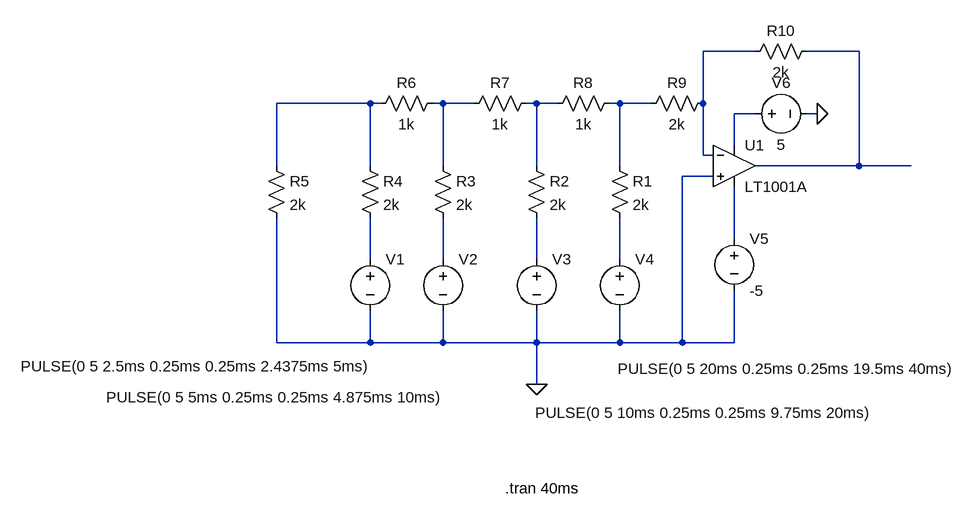
[diagram p0: schematic Design_DAC.asc]
Design_DAC.asc, the LTspice schematic file:
Version 4
SHEET 1 1000 840
WIRE 656 128 576 128
WIRE 816 128 736 128
WIRE 64 208 -80 208
WIRE 80 208 64 208
WIRE 176 208 160 208
WIRE 224 208 176 208
WIRE 320 208 304 208
WIRE 352 208 320 208
WIRE 448 208 432 208
WIRE 496 208 448 208
WIRE 576 208 576 128
WIRE 656 224 624 224
WIRE 752 224 736 224
WIRE 624 272 624 224
WIRE 576 288 576 208
WIRE 592 288 576 288
WIRE -80 304 -80 208
WIRE 64 304 64 208
WIRE 176 304 176 208
WIRE 320 304 320 208
WIRE 448 304 448 208
WIRE 816 304 816 128
WIRE 816 304 656 304
WIRE 896 304 816 304
WIRE 592 320 544 320
WIRE 624 416 624 336
WIRE 64 448 64 384
WIRE 176 448 176 384
WIRE 320 448 320 384
WIRE 448 448 448 384
WIRE -80 576 -80 384
WIRE 64 576 64 528
WIRE 64 576 -80 576
WIRE 176 576 176 528
WIRE 176 576 64 576
WIRE 320 576 320 528
WIRE 320 576 176 576
WIRE 448 576 448 528
WIRE 448 576 320 576
WIRE 544 576 544 320
WIRE 544 576 448 576
WIRE 624 576 624 496
WIRE 624 576 544 576
WIRE 320 640 320 576
FLAG 752 224 0
FLAG 320 640 0
SYMBOL OpAmps/LT1001A 624 240 R0
SYMATTR InstName U1
SYMBOL res 432 288 R0
SYMATTR InstName R1
SYMATTR Value 2k
SYMBOL res 304 288 R0
SYMATTR InstName R2
SYMATTR Value 2k
SYMBOL res 160 288 R0
SYMATTR InstName R3
SYMATTR Value 2k
SYMBOL res 48 288 R0
SYMATTR InstName R4
SYMATTR Value 2k
SYMBOL res -96 288 R0
SYMATTR InstName R5
SYMATTR Value 2k
SYMBOL res 176 192 R90
WINDOW 0 0 56 VBottom 2
WINDOW 3 32 56 VTop 2
SYMATTR InstName R6
SYMATTR Value 1k
SYMBOL res 320 192 R90
WINDOW 0 0 56 VBottom 2
WINDOW 3 32 56 VTop 2
SYMATTR InstName R7
SYMATTR Value 1k
SYMBOL res 448 192 R90
WINDOW 0 0 56 VBottom 2
WINDOW 3 32 56 VTop 2
SYMATTR InstName R8
SYMATTR Value 1k
SYMBOL res 592 192 R90
WINDOW 0 0 56 VBottom 2
WINDOW 3 32 56 VTop 2
SYMATTR InstName R9
SYMATTR Value 2k
SYMBOL res 752 112 R90
WINDOW 0 0 56 VBottom 2
WINDOW 3 32 56 VTop 2
SYMATTR InstName R10
SYMATTR Value 2k
SYMBOL voltage 64 432 R0
WINDOW 3 -268 196 Bottom 2
SYMATTR Value PULSE(0 5 2.5ms 0.25ms 0.25ms 2.4375ms 5ms)
SYMATTR InstName V1
SYMBOL voltage 176 432 R0
WINDOW 3 -259 228 Center 2
SYMATTR Value PULSE(0 5 5ms 0.25ms 0.25ms 4.875ms 10ms)
SYMATTR InstName V2
SYMBOL voltage 320 432 R0
WINDOW 3 -2 252 Left 2
SYMATTR InstName V3
SYMATTR Value PULSE(0 5 10ms 0.25ms 0.25ms 9.75ms 20ms)
SYMBOL voltage 448 432 R0
WINDOW 3 -3 184 Left 2
SYMATTR InstName V4
SYMATTR Value PULSE(0 5 20ms 0.25ms 0.25ms 19.5ms 40ms)
SYMBOL voltage 624 400 R0
SYMATTR InstName V5
SYMATTR Value -5
SYMBOL voltage 640 224 R270
WINDOW 0 32 56 VTop 2
WINDOW 3 -32 56 VBottom 2
SYMATTR InstName V6
SYMATTR Value 5
TEXT 272 800 Left 2 !.tran 40ms

The netlist it stands for:
* Design_DAC.asc
XU1 0 N001 N007 N008 N002 LT1001  ; LT1001A, pins In+ In- V+ V- OUT
R1 N006 N012 2k
R2 N005 N011 2k
R3 N004 N010 2k
R4 N003 N009 2k
R5 N003 0 2k
R6 N004 N003 1k
R7 N005 N004 1k
R8 N006 N005 1k
R9 N001 N006 2k
R10 N002 N001 2k
V1 N009 0 PULSE(0 5 2.5ms 0.25ms 0.25ms 2.4375ms 5ms)
V2 N010 0 PULSE(0 5 5ms 0.25ms 0.25ms 4.875ms 10ms)
V3 N011 0 PULSE(0 5 10ms 0.25ms 0.25ms 9.75ms 20ms)
V4 N012 0 PULSE(0 5 20ms 0.25ms 0.25ms 19.5ms 40ms)
V5 N008 0 -5
V6 N007 0 5
.tran 40ms
.lib LTC.lib
.backanno
.end